# Altium project Main _Rotor_Roll v1.1_Project.PrjPcb
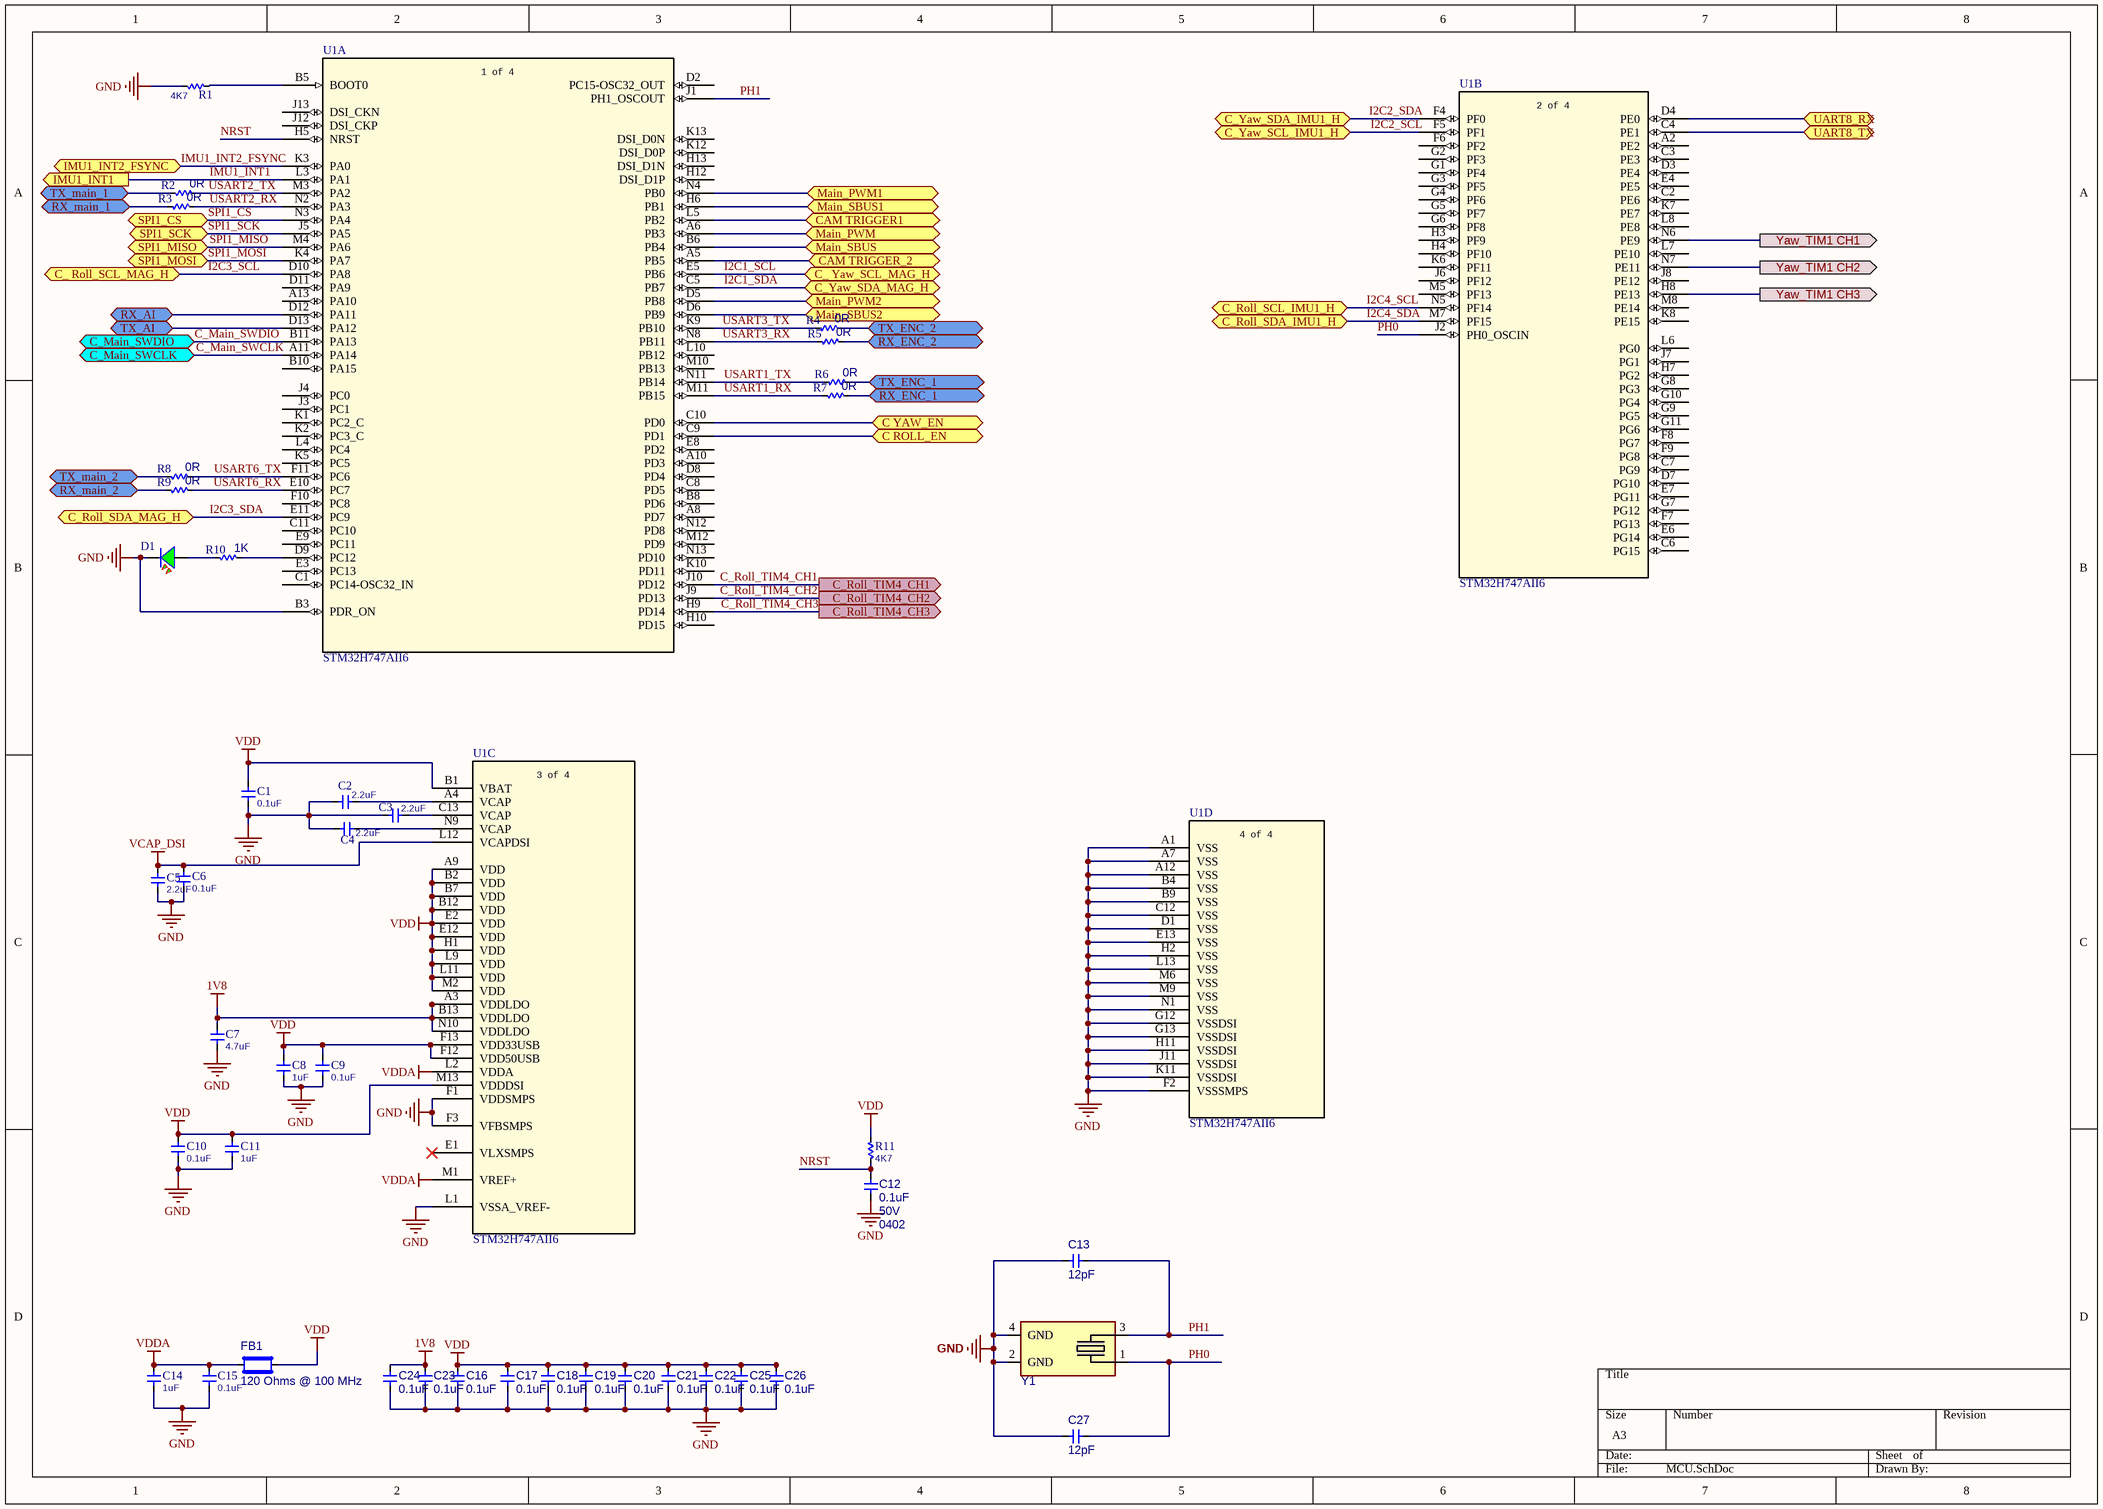
[diagram p0: MCU.SchDoc]
5 sheets, 100 parts. Net scope: flat (ports and power ports of the same name join across sheets).
Board file: MAIN.PcbDoc
Sheets:
  MCU.SchDoc
  PWR.SchDoc
  IMU.SchDoc
  Connector.SchDoc
  RS232.SchDoc

## Sheet MCU.SchDoc
size A3; SheetNumber: 1; SheetTotal: 5

### Parts
C1  value 0.1uF  [CAP0402]  (hidden comment: CAP0402)
C2  value 2.2uF  [CAP0402]  (hidden comment: CAP0402)
C3  value 2.2uF  [CAP0402]  (hidden comment: CAP0402)
C4  value 2.2uF  [CAP0402]  (hidden comment: CAP0402)
C5  value 2.2uF  [CAP0402]  (hidden comment: CAP0402)
C6  value 0.1uF  [CAP0402]  (hidden comment: CAP0402)
C7  value 4.7uF  [CAP0402]  (hidden comment: CAP0402)
C8  value 1uF  [CAP0402]  (hidden comment: CAP0402)
C9  value 0.1uF  [CAP0402]  (hidden comment: CAP0402)
C10  value 0.1uF  [CAP0402]  (hidden comment: CAP0402)
C11  value 1uF  [CAP0402]  (hidden comment: CAP0402)
C12  value 0.1uF  Voltage: 50V  Package: 0402  [CAP0402]  (hidden comment: CAP0402 0.1uF 50V)
C13  value 12pF  [CAP0402]  (hidden comment: CAP0402 12pF 50V)
C14  value 1uF  [CAP0402]  (hidden comment: CAP0402)
C15  value 0.1uF  [CAP0402]  (hidden comment: CAP0402)
C16  value 0.1uF  [CAP0402]  (hidden comment: CAP0402 0.1uF 50V)
C17  value 0.1uF  [CAP0402]  (hidden comment: CAP0402 0.1uF 50V)
C18  value 0.1uF  [CAP0402]  (hidden comment: CAP0402 0.1uF 50V)
C19  value 0.1uF  [CAP0402]  (hidden comment: CAP0402 0.1uF 50V)
C20  value 0.1uF  [CAP0402]  (hidden comment: CAP0402 0.1uF 50V)
C21  value 0.1uF  [CAP0402]  (hidden comment: CAP0402 0.1uF 50V)
C22  value 0.1uF  [CAP0402]  (hidden comment: CAP0402 0.1uF 50V)
C23  value 0.1uF  [CAP0402]  (hidden comment: CAP0402 0.1uF 50V)
C24  value 0.1uF  [CAP0402]  (hidden comment: CAP0402 0.1uF 50V)
C25  value 0.1uF  [CAP0402]  (hidden comment: CAP0402 0.1uF 50V)
C26  value 0.1uF  [CAP0402]  (hidden comment: CAP0402 0.1uF 50V)
C27  value 12pF  [CAP0402]  (hidden comment: CAP0402 12pF 50V)
D1  SML-310MTT86  [LED0603 GREEN]  (value not drawn)
FB1  Impedance @ Frequency: 120 Ohms @ 100 MHz  [FERRIT0402]  (hidden comment: BLM15PX121SZ1D)
R1  value 4K7  [RES0402]  (hidden comment: RES0402 4K7)
R2  value 0R  [RES0402]  (hidden comment: RES0402 0R)
R3  value 0R  [RES0402]  (hidden comment: RES0402 0R)
R4  value 0R  [RES0402]  (hidden comment: RES0402 0R)
R5  value 0R  [RES0402]  (hidden comment: RES0402 0R)
R6  value 0R  [RES0402]  (hidden comment: RES0402 0R)
R7  value 0R  [RES0402]  (hidden comment: RES0402 0R)
R8  value 0R  [RES0402]  (hidden comment: RES0402 0R)
R9  value 0R  [RES0402]  (hidden comment: RES0402 0R)
R10  value 1K  [RES0402]  (hidden comment: RES0402 0R)
R11  value 4K7  [RES0402]  (hidden comment: RES0402 4K7)
U1  STM32H747AII6  [UFBGA169]  (parts A,B,C,D of 4)
Y1  ECS-240-12-37B-CKY-TR  [XTAL_ECS-240-12-37B-CKY-TR]  (value not drawn)

### Ports
C ROLL_EN (bidir), C YAW_EN (bidir), C_ Roll_SCL_MAG_H (bidir), C_ Yaw_SCL_MAG_H (bidir), C_Main_SWCLK (bidir), C_Main_SWDIO (bidir), C_Roll_SCL_IMU1_H (bidir), C_Roll_SDA_IMU1_H (bidir), C_Roll_SDA_MAG_H (bidir), C_Roll_TIM4_CH1 (out), C_Roll_TIM4_CH2 (out), C_Roll_TIM4_CH3 (out), C_Yaw_SCL_IMU1_H (bidir), C_Yaw_SDA_IMU1_H (bidir), C_Yaw_SDA_MAG_H (bidir), CAM TRIGGER1 (bidir), CAM TRIGGER_2 (bidir), IMU1_INT1 (out), IMU1_INT2_FSYNC (bidir), Main_PWM1 (bidir), Main_PWM2 (bidir), Main_PWM (bidir), Main_SBUS1 (bidir), Main_SBUS2 (bidir), Main_SBUS (bidir), RX_AI (bidir), RX_ENC_1 (bidir), RX_ENC_2 (bidir), RX_main_1 (bidir), RX_main_2 (bidir), SPI1_CS (bidir), SPI1_MISO (bidir), SPI1_MOSI (bidir), SPI1_SCK (bidir), TX_AI (bidir), TX_ENC_1 (bidir), TX_ENC_2 (bidir), TX_main_1 (bidir), TX_main_2 (bidir), UART8_RX (bidir), UART8_TX (bidir), Yaw_TIM1 CH1 (out), Yaw_TIM1 CH2 (out), Yaw_TIM1 CH3 (out)

### Nets
1V8: C7.2 C23.2 C24.2 U1.A3(VDDLDO) U1.B13(VDDLDO) U1.N10(VDDLDO)
GND: C1.1 C2.1 C3.1 C4.1 C5.1 C6.1 C7.1 C8.1 C9.1 C10.1 C11.1 C12.1 C13.2 C14.1 C15.1 C16.1 C17.1 C18.1 C19.1 C20.1 C21.1 C22.1 C23.1 C24.1 C25.1 C26.1 C27.2 D1.1 R1.1 U1.A1(VSS) U1.A7(VSS) U1.A12(VSS) U1.B3(PDR_ON) U1.B4(VSS) U1.B9(VSS) U1.C12(VSS) U1.D1(VSS) U1.E13(VSS) U1.F1(VDDSMPS) U1.F2(VSSSMPS) U1.F3(VFBSMPS) U1.G12(VSSDSI) U1.G13(VSSDSI) U1.H2(VSS) U1.H11(VSSDSI) U1.J11(VSSDSI) U1.K11(VSSDSI) U1.L1(VSSA_VREF-) U1.L13(VSS) U1.M6(VSS) U1.M9(VSS) U1.N1(VSS) Y1.2(GND) Y1.4(GND)
VCAP_DSI: C5.2 C6.2 U1.L12(VCAPDSI)
VDD: C1.2 C8.2 C9.2 C10.2 C11.2 C16.2 C17.2 C18.2 C19.2 C20.2 C21.2 C22.2 C25.2 C26.2 FB1.2 R11.2 U1.A9(VDD) U1.B1(VBAT) U1.B2(VDD) U1.B7(VDD) U1.B12(VDD) U1.E2(VDD) U1.E12(VDD) U1.F12(VDD50USB) U1.F13(VDD33USB) U1.H1(VDD) U1.L9(VDD) U1.L11(VDD) U1.M2(VDD) U1.M13(VDDDSI)
VDDA: C14.2 C15.2 FB1.1 U1.L2(VDDA) U1.M1(VREF+)
C_Main_SWCLK: U1.A11(PA14) ; port C_Main_SWCLK
C_Main_SWDIO: U1.B11(PA13) ; port C_Main_SWDIO
C_Roll_TIM4_CH1: U1.J10(PD12) ; port C_Roll_TIM4_CH1
C_Roll_TIM4_CH2: U1.J9(PD13) ; port C_Roll_TIM4_CH2
C_Roll_TIM4_CH3: U1.H9(PD14) ; port C_Roll_TIM4_CH3
C_Yaw_TIM1_CH1: U1.N6(PE9) ; port Yaw_TIM1 CH1
C_Yaw_TIM1_CH2: U1.N7(PE11) ; port Yaw_TIM1 CH2
C_Yaw_TIM1_CH3: U1.H8(PE13) ; port Yaw_TIM1 CH3
I2C1_SCL: U1.E5(PB6) ; port C_ Yaw_SCL_MAG_H
I2C1_SDA: U1.C5(PB7) ; port C_Yaw_SDA_MAG_H
I2C2_SCL: U1.F5(PF1) ; port C_Yaw_SCL_IMU1_H
I2C2_SDA: U1.F4(PF0) ; port C_Yaw_SDA_IMU1_H
I2C3_SCL: U1.D10(PA8) ; port C_ Roll_SCL_MAG_H
I2C3_SDA: U1.E11(PC9) ; port C_Roll_SDA_MAG_H
I2C4_SCL: U1.N5(PF14) ; port C_Roll_SCL_IMU1_H
I2C4_SDA: U1.M7(PF15) ; port C_Roll_SDA_IMU1_H
IMU1_INT1: U1.L3(PA1) ; port IMU1_INT1
IMU1_INT2_FSYNC: U1.K3(PA0) ; port IMU1_INT2_FSYNC
NRST: C12.2 R11.1 U1.H5(NRST)
PH0: C27.1 U1.J2(PH0_OSCIN) Y1.1(IO)
PH1: C13.1 U1.J1(PH1_OSCOUT) Y1.3(IO)
RX_AI: U1.D12(PA11) ; port RX_AI
SPI1_CS: U1.N3(PA4) ; port SPI1_CS
SPI1_MISO: U1.M4(PA6) ; port SPI1_MISO
SPI1_MOSI: U1.K4(PA7) ; port SPI1_MOSI
SPI1_SCK: U1.J5(PA5) ; port SPI1_SCK
TX_AI: U1.D13(PA12) ; port TX_AI
USART1_RX: R7.1 U1.M11(PB15)
USART1_TX: R6.1 U1.N11(PB14)
USART2_RX: R3.2 U1.N2(PA3)
USART2_TX: R2.2 U1.M3(PA2)
USART3_RX: R5.1 U1.N8(PB11)
USART3_TX: R4.1 U1.K9(PB10)
USART6_RX: R9.2 U1.E10(PC7)
USART6_TX: R8.2 U1.F11(PC6)
NetC2_2: C2.2 U1.A4(VCAP)
NetC3_2: C3.2 U1.C13(VCAP)
NetC4_2: C4.2 U1.N9(VCAP)
NetD1_2: D1.2 R10.1
NetP1_11: U1.C10(PD0) ; port C YAW_EN
NetP1_27: U1.B6(PB4) ; port Main_SBUS
NetP1_29: U1.A6(PB3) ; port Main_PWM
NetP1_32: U1.N4(PB0) ; port Main_PWM1
NetP1_34: U1.H6(PB1) ; port Main_SBUS1
NetP1_44: U1.D5(PB8) ; port Main_PWM2
NetP1_46: U1.D6(PB9) ; port Main_SBUS2
NetP2_20: U1.C9(PD1) ; port C ROLL_EN
NetP2_50: U1.L5(PB2) ; port CAM TRIGGER1
NetP2_52: U1.A5(PB5) ; port CAM TRIGGER_2
NetR1_2: R1.2 U1.B5(BOOT0)
NetR2_1: R2.1 ; port TX_main_1
NetR3_1: R3.1 ; port RX_main_1
NetR4_2: R4.2 ; port TX_ENC_2
NetR5_2: R5.2 ; port RX_ENC_2
NetR6_2: R6.2 ; port TX_ENC_1
NetR7_2: R7.2 ; port RX_ENC_1
NetR8_1: R8.1 ; port TX_main_2
NetR9_1: R9.1 ; port RX_main_2
NetR10_2: R10.2 U1.D9(PC12)
NetU1_C4: U1.C4(PE1) ; port UART8_TX
NetU1_D4: U1.D4(PE0) ; port UART8_RX

Not connected (* = marked no-connect by the designer): U1 A2(PE2) A8(PD7) A10(PD3) A13(PA10) B8(PD6) B10(PA15) C1(PC14-OSC32_IN) C2(PE6) C3(PE3) C6(PG15) C7(PG9) C8(PD5) C11(PC10) D2(PC15-OSC32_OUT) D3(PE4) D7(PG10) D8(PD4) D11(PA9) E1(VLXSMPS)* E3(PC13) E4(PE5) E6(PG14) E7(PG11) E8(PD2) E9(PC11) F6(PF2) F7(PG13) F8(PG7) F9(PG8) F10(PC8) G1(PF4) G2(PF3) G3(PF5) G4(PF6) G5(PF7) G6(PF8) G7(PG12) G8(PG3) G9(PG5) G10(PG4) G11(PG6) H3(PF9) H4(PF10) H7(PG2) H10(PD15) H12(DSI_D1P) H13(DSI_D1N) J3(PC1) J4(PC0) J6(PF12) J7(PG1) J8(PE12) J12(DSI_CKP) J13(DSI_CKN) K1(PC2_C) K2(PC3_C) K5(PC5) K6(PF11) K7(PE7) K8(PE15) K10(PD11) K12(DSI_D0P) K13(DSI_D0N) L4(PC4) L6(PG0) L7(PE10) L8(PE8) L10(PB12) M5(PF13) M8(PE14) M10(PB13) M12(PD9) N12(PD8) N13(PD10)

### Notes on the sheet
- (in symbol STM32H747AII6, part A) 1 of 4
- (in symbol STM32H747AII6, part B) 2 of 4
- (in symbol STM32H747AII6, part C) 3 of 4
- (in symbol STM32H747AII6, part D) 4 of 4

### Library data of the parts
C1-C11 C14 C15 = CAP0402: Cap 0402; MP: add later
C12 C16-C26 = CAP0402 0.1uF 50V: Cap 0.1uF 50V 0402; MP: CC0402KRX5R9BB104
  C16-C26: Voltage: 50V; Package: 0402
C13 C27 = CAP0402 12pF 50V: Cap 12pF 50V 0402
D1 = CMP-01130-2: LED GREEN CLEAR 0603 SMD; Manufacturer 1: Rohm Semiconductor; Luminous Intensity: 16mcd; Wavelength: 570nm; Number of LEDs: 1; Color: Green,Yellow; Forward Voltage: 2.2V; Lens Color: Colorless,Clear; Forward Current: 20mA; Viewing Angle: 140°; Lens Style: Rectangular,Clear,Diffused,Colorless; Case Code (Imperial): 0603; Lens Transparency: Clear; Package Quantity: 3000; Width: 0.8mm; Manufacturer Part Number 1: SML-310MTT86; Min Operating Temperature: -30°C; Length: 1.6mm; Packaging: Tape and Reel; Dominant Wavelength: 570nm; Height: 0.9mm; Radiation Hardening: No; Test Current: 20mA; Case Code (Metric): 1608; Lead Free: Lead Free; Case/Package: 0603; Mount: Surface Mount; Max Operating Temperature: 85°C; Illumination Color: Green; Number of Pins: 2
FB1 = BLM15PX121SZ1D: 120 Ohms @ 100 MHz 1 Power Line Ferrite Bead 0402 (1005 Metric) 2A 55mOhm; MP: BLM15PX121SZ1D; Current Rating (Max): 2A; DC Resistance (DCR) (Max): 55mOhm
R1 R11 = RES0402 4K7: RES 4K7 0402; MP: RC0402JR-074K7L
R2-R10 = RES0402 0R: RES 0R 0402; MP: RC0402JR-070RL
U1 = STM32H747AII6: High-performance and DSP with DP-FPU, Arm Cortex-M7 + Cortex-M4 MCU with 2MBytes of Flash memory, 1MB RAM, 480 MHz CPU, Art Accelerator, L1 cache, external memory interface, large set of peripherals, SMPS, MIPI-DSI; Manufacturer_Name: STMicroelectronics; Copyright: Copyright (C) 2026 Ultra Librarian. All rights reserved.; Manufacturer_Part_Number: STM32H747AII6; RefDes: RefDes; Type: Type
Y1 = ECS-240-12-37B-CKY-TR: Crystal 24 MHz ±10ppm 12pF 50 Ohms 4-SMD, No Lead; Frequency: 24 MHz; ESR (Equivalent Series Resistance): 50 Ohms; MP: ECS-240-12-37B-CKY-TR; Frequency Stability: ±10ppm; Frequency Tolerance: ±10ppm; Load Capacitance: 12pF; Operating Temperature: -30°C ~ 85°C; Size / Dimension: 2.00mm x 1.60mm

## Sheet PWR.SchDoc
size A; SheetNumber: 2; SheetTotal: 5
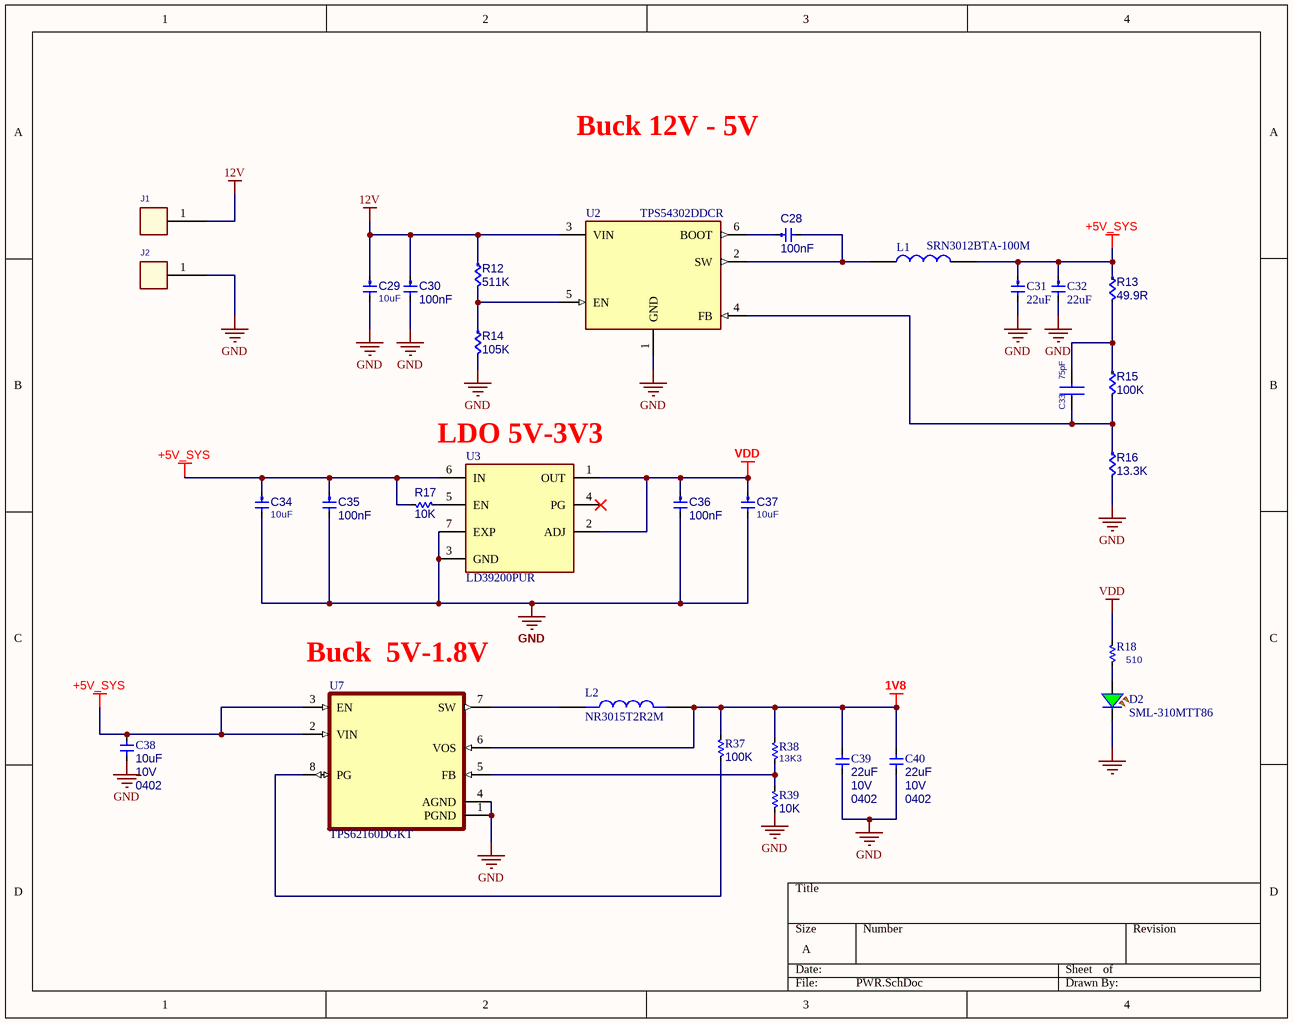
[diagram p1: PWR.SchDoc]

### Parts
(Parts that share a designator on the sheet are numbered #1, #2 ... from top to bottom, then left to right.)
C28  Capacitance: 100nF  [CAP0402]  (hidden comment: CC0402KRX5R9BB104)
C29  Capacitance: 10uF  [CAP0603]  (hidden comment: GRM188R6YA106MA73D)
C30  Capacitance: 100nF  [CAP0402]  (hidden comment: CC0402KRX5R9BB104)
C31  Capacitance: 22uF  [CAP0402]  (hidden comment: GRM158R61A226ME15D)
C32  Capacitance: 22uF  [CAP0402]  (hidden comment: GRM158R61A226ME15D)
C33  75pF  [CAP0402]
C34  Capacitance: 10uF  [CAP0603]  (hidden comment: GRM188R6YA106MA73D)
C35  Capacitance: 100nF  [CAP0402]  (hidden comment: CC0402KRX5R9BB104)
C36  Capacitance: 100nF  [CAP0402]  (hidden comment: CC0402KRX5R9BB104)
C37  Capacitance: 10uF  [CAP0603]  (hidden comment: GRM188R6YA106MA73D)
C38#1  value 10uF  Voltage: 10V  Package: 0402  [CAP0402]  (hidden comment: CAP0402 10uF 10V)
C39#1  value 22uF  Voltage: 10V  Package: 0402  [CAP0402]  (hidden comment: CAP0402 22uF 10V)
C40#1  value 22uF  Voltage: 10V  Package: 0402  [CAP0402]  (hidden comment: CAP0402 22uF 10V)
D2  SML-310MTT86  [LED0603 GREEN]
J1  CON1  [ESC PAD 3X4]  (value not drawn)
J2  CON1  [ESC PAD 3X4]  (value not drawn)
L1  SRN3012BTA-100M  [SRN3012BTA-100M]
L2  NR3015T2R2M  [IND_NR3015T2R2M]
R12  511K  [RES0402]
R13  49.9R  [RES0402]
R14  105K  [RES0402]
R15  100K  [RES0402]
R16  13.3K  [RES0402]
R17  value 10K  [RES0402]  (hidden comment: RES0402 10K)
R18  value 510  [RES0402]  (hidden comment: RES0402)
R37  value 100K  [RES0402]  (hidden comment: RES0402 100K)
R38  value 13K3  [RES0402]  (hidden comment: RES0402 13K3)
R39  value 10K  [RES0402]  (hidden comment: RES0402 10K)
U2  TPS54302DDCR  [SOT95P280X110-6N - duplicate1]
U3  LD39200PUR  [LD39200PUR]
U7  TPS62160DGKT  [SOP65P490X110-8N]

### Nets
1V8: C39#1.2 C40#1.2 L2.2 R37.2 R38.2 U7.6(VOS)
12V: C29.1 C30.1 J1.1 R12.1 U2.3(VIN)
+5V_SYS: C31.1 C32.1 C34.1 C35.1 C38#1.2 L1.2 R13.1 R17.2 U3.6(IN) U7.2(VIN) U7.3(EN)
GND: C29.2 C30.2 C31.2 C32.2 C34.2 C35.2 C36.2 C37.2 C38#1.1 C39#1.1 C40#1.1 D2.1 J2.1 R14.2 R16.2 R39.1 U2.1(GND) U3.3(GND) U3.7(EXP) U7.1(PGND) U7.4(AGND)
VDD: C36.1 C37.1 R18.1 U3.1(OUT) U3.2(ADJ)
NetC28_1: C28.1 U2.6(BOOT)
NetC28_2: C28.2 L1.1 U2.2(SW)
NetC33_1: C33.1 R15.2 R16.1 U2.4(FB)
NetC33_2: C33.2 R13.2 R15.1
NetD2_2: D2.2 R18.2
NetL2_1: L2.1 U7.7(SW)
NetR12_2: R12.2 R14.1 U2.5(EN)
NetR17_1: R17.1 U3.5(EN)
NetR37_1: R37.1 U7.8(PG)
NetR38_1: R38.1 R39.2 U7.5(FB)

Not connected (* = marked no-connect by the designer): U3 4(PG)*

### Notes on the sheet
- Buck 12V - 5V
- (near U3) LDO 5V-3V3
- (near U7) Buck  5V-1.8V

### Library data of the parts
C28 C30 C35 C36 = CMP-00265-1: CAP CER 0.1UF 50V X5R 0402; Manufacturer: Yageo; Tolerance: 10%; Voltage Rating: 50V; Dielectric: X5R; Width: 0.02inch; Thickness: 0.022inch; Packaging: Tape and Reel; Length: 0.039inch; Mount: Surface Mount; Case/Package: 0402; Min Operating Temperature: -55°C; Halogen Free: Halogen Free; Voltage Rating (DC): 50V; Manufacturer Part Number: CC0402KRX5R9BB104; Max Operating Temperature: 85°C; Lead Free: Lead Free; Manufacturer 1: Yageo; Manufacturer Part Number 1: CC0402KRX5R9BB104
C29 C34 C37 = CMP-01031-1: CAP CER 10UF 35V X5R 0603; Manufacturer 1: Murata Electronics; Tolerance: 20%; Case/Package: 0603; Depth: 0.8mm; Composition: Ceramic; Length: 1.6mm; Max Operating Temperature: 85°C; Lead Free: Lead Free; Thickness: 0.031inch; Number of Pins: 2; Weight: 0.000222oz; Min Operating Temperature: -55°C; REACH SVHC: No SVHC; Case Code (Metric): 1608; Termination: SMD/SMT; Packaging: Tape and Reel; Height: 0.8mm; Voltage Rating (DC): 35V; Width: 0.031inch; Voltage Rating: 35V; Manufacturer Part Number 1: GRM188R6YA106MA73D; Mount: Surface Mount; Package Quantity: 1; Case Code (Imperial): 0603; Dielectric: X5R; Voltage: 35V
C31 C32 = CMP-00520-1: CAP CER 22UF 10V X5R 0402; Manufacturer 1: TDK Corporation; Tolerance: 10%; Case Code (Imperial): 0402; Case/Package: 0402; Voltage: 10V; Min Operating Temperature: -55°C; Termination: SMD/SMT; Voltage Rating: 10V; Length: 1mm; REACH SVHC: No SVHC; Max Operating Temperature: 85°C; Radiation Hardening: No; Depth: 0.5mm; Case Code (Metric): 1005; Dielectric: X5R; Manufacturer Part Number 1: GRM158R61A226ME15D; Packaging: Tape and Reel
C33 = CAP_Dup1_16: CAP CER 75PF 25V C0G/NP0 0402; Manufacturer PN: CC0402JRNPO9BN750; Manufacturer: YAGEO; PART_NUMBER: TMP-416; CLASS: DISCRETE; Tolerance: 5%; Temperature Coefficient: C0G, NP0; Dielectric Type: Capacitors; Rated Voltage: 25V; Package Size: 0402 (1005 Metric)
C38#1 = CAP0402 10uF 10V: Cap 10uF 10V 0402; MP: GRT155R61A106ME13D
C39#1 C40#1 = CAP0402 22uF 10V: Cap 22uF 10V 0402; MP: GRM158R61A226ME15D
D2 = CMP-01130-2: as D1 on sheet MCU; Case Code (Imperial): 0603; Lens Transparency: Clear; Package Quantity: 3000; Width: 0.8mm; Manufacturer Part Number 1: SML-310MTT86; Min Operating Temperature: -30°C; Length: 1.6mm; Packaging: Tape and Reel; Dominant Wavelength: 570nm; Height: 0.9mm; Radiation Hardening: No; Test Current: 20mA; Case Code (Metric): 1608; Lead Free: Lead Free; Case/Package: 0603; Mount: Surface Mount; Max Operating Temperature: 85°C; Illumination Color: Green; Number of Pins: 2
J1 J2 = CON1: SOLDER PADS
L1 = SRN3012BTA-330M: 10uH; Manufacturer_Name: Bourns; Geometry.Height: 1.2mm; Mouser Part Number: SRN3012BTA-100M; Mouser Price/Stock: https://www.mouser.co.uk/ProductDetail/Bourns/SRN3012BTA-330M?qs=Imq1NPwxi74rPoSZ4PPaRw%3D%3D; Manufacturer_Part_Number: SRN3012BTA-100M; Datasheet Link: https://www.bourns.com/docs/Product-Datasheets/SRN3012BTA.pdf
L2 = NR3015T2R2M: 2.2 ÂµH Shielded Drum Core, Wirewound Inductor 1.5 A 72mOhm Max Nonstandard; MF: Taiyo Yuden; MP: NR3015T2R2M; Price: None; Purchase-URL: https://pricing.snapeda.com/search/part/NR3015T2R2M/?ref=eda; Package: Nonstandard Taiyo Yuden; Check_prices: https://www.snapeda.com/parts/NR3015T2R2M/Taiyo+Yuden/view-part/?ref=eda; Value: *; Availability: In Stock; SnapEDA_Link: https://www.snapeda.com/parts/NR3015T2R2M/Taiyo+Yuden/view-part/?ref=snap
R12 = CMP-00299-1_1: RES SMD 511K OHM 1% 1/16W 0402; Manufacturer: Yageo; Manufacturer Part Number: RC0402FR-07511KL; Temperature Coefficient: 100ppm/°C; Working Voltage: 50V; Max Power Dissipation: 63mW; Power Rating: 62.5mW; Height: 0.016inch; Package Quantity: 1; Min Operating Temperature: -55°C; Tolerance: 1%; Military Standard: Not; Packaging: Tape and Reel; Number of Terminations: 2; Width: 0.02inch; Case/Package: 0402; Length: 1mm; Voltage Rating (DC): 50V; Case Code (Metric): 1005; Resistance: 511K; Composition: Thick Film; Voltage Rating: 50V; Max Operating Temperature: 155°C; Case Code (Imperial): 0402; Lead Free: Lead Free; Termination: SMD/SMT; Features: Moisture Resistant; Depth: 0.5mm; Manufacturer 1: Yageo; Manufacturer Part Number 1: RC0402FR-07511KL
R13 = CMP-00299-1_1: RES SMD 49.9R OHM 1% 1/16W 0402; Manufacturer: Yageo; Manufacturer Part Number: RC0402FR-0749R9L; Temperature Coefficient: 100ppm/°C; Working Voltage: 50V; Max Power Dissipation: 63mW; Power Rating: 62.5mW; Height: 0.016inch; Package Quantity: 1; Min Operating Temperature: -55°C; Tolerance: 1%; Military Standard: Not; Packaging: Tape and Reel; Number of Terminations: 2; Width: 0.02inch; Case/Package: 0402; Length: 1mm; Voltage Rating (DC): 50V; Case Code (Metric): 1005; Resistance: 49.9R; Composition: Thick Film; Voltage Rating: 50V; Max Operating Temperature: 155°C; Case Code (Imperial): 0402; Lead Free: Lead Free; Termination: SMD/SMT; Features: Moisture Resistant; Depth: 0.5mm; Manufacturer 1: Yageo; Manufacturer Part Number 1: RC0402FR-0749R9L
R14 = CMP-00299-1_1: RES SMD 105K OHM 1% 1/16W 0402; Manufacturer: Yageo; Manufacturer Part Number: RC0402FR-07105KL; Temperature Coefficient: 100ppm/°C; Working Voltage: 50V; Max Power Dissipation: 63mW; Power Rating: 62.5mW; Height: 0.016inch; Package Quantity: 1; Min Operating Temperature: -55°C; Tolerance: 1%; Military Standard: Not; Packaging: Tape and Reel; Number of Terminations: 2; Width: 0.02inch; Case/Package: 0402; Length: 1mm; Voltage Rating (DC): 50V; Case Code (Metric): 1005; Resistance: 105K; Composition: Thick Film; Voltage Rating: 50V; Max Operating Temperature: 155°C; Case Code (Imperial): 0402; Lead Free: Lead Free; Termination: SMD/SMT; Features: Moisture Resistant; Depth: 0.5mm; Manufacturer 1: Yageo; Manufacturer Part Number 1: RC0402FR-07105KL
R15 = CMP-00299-1_1: RES SMD 100K OHM 1% 1/16W 0402; Manufacturer: Yageo; Manufacturer Part Number: RC0402FR-0749R9L; Temperature Coefficient: 100ppm/°C; Working Voltage: 50V; Max Power Dissipation: 63mW; Resistance: 49.9R; Power Rating: 62.5mW; Height: 0.016inch; Package Quantity: 1; Min Operating Temperature: -55°C; Tolerance: 1%; Military Standard: Not; Packaging: Tape and Reel; Number of Terminations: 2; Width: 0.02inch; Case/Package: 0402; Length: 1mm; Voltage Rating (DC): 50V; Case Code (Metric): 1005; Composition: Thick Film; Voltage Rating: 50V; Max Operating Temperature: 155°C; Case Code (Imperial): 0402; Lead Free: Lead Free; Termination: SMD/SMT; Features: Moisture Resistant; Depth: 0.5mm; Manufacturer 1: Yageo; Manufacturer Part Number 1: RC0402FR-0749R9L
R16 = CMP-00299-1_1: RES SMD 13.3K OHM 1% 1/16W 0402; Manufacturer: Yageo; Manufacturer Part Number: RC0402FR-0749R9L; Temperature Coefficient: 100ppm/°C; Working Voltage: 50V; Max Power Dissipation: 63mW; Resistance: 49.9R; Power Rating: 62.5mW; Height: 0.016inch; Package Quantity: 1; Min Operating Temperature: -55°C; Tolerance: 1%; Military Standard: Not; Packaging: Tape and Reel; Number of Terminations: 2; Width: 0.02inch; Case/Package: 0402; Length: 1mm; Voltage Rating (DC): 50V; Case Code (Metric): 1005; Composition: Thick Film; Voltage Rating: 50V; Max Operating Temperature: 155°C; Case Code (Imperial): 0402; Lead Free: Lead Free; Termination: SMD/SMT; Features: Moisture Resistant; Depth: 0.5mm; Manufacturer 1: Yageo; Manufacturer Part Number 1: RC0402FR-0749R9L
R17 R39 = RES0402 10K: RES 10K 0402; MP: RC0402FR-0710KL
R18 = RES0402: RES 0402; MP: add later
R37 = RES0402 100K: RES 100K 0402; MP: RC0402FR-07100KL
R38 = RES0402 13K3: RES 13K3 0402; MP: RC0402FR-0713K3L
U2 = TPS54302DDCR: 4.5-V to 28-V Input, 3-A Output, EMI Friendly Synchronous Step-Down Converter; MF: Texas Instruments; Package: SOT-23-THN-6 Texas Instruments; Price: None; Check_prices: https://www.snapeda.com/parts/TPS54302DDCR/Texas+Instruments/view-part/?ref=eda; Value: *; SnapEDA_Link: https://www.snapeda.com/parts/TPS54302DDCR/Texas+Instruments/view-part/?ref=snap; MP: TPS54302DDCR; Availability: In Stock; Purchase-URL: https://pricing.snapeda.com/search?q=TPS54302DDCR&ref=eda
U3 = LD39200PUR: LDO IC 1 Output 2A 6-DFN _3x3_; MF: STMicroelectronics; Package: DFN-6 STMicroelectronics; Availability: Unavailable; MP: LD39200PUR; Value: *; SnapEDA_Link: https://www.snapeda.com/parts/LD39200PUR/STMicroelectronics/view-part/882017/?ref=snap; Price: None
U7 = TPS62160DGKT: 3V-17V 1A Step-Down Converters with DCS-Controlâ„¢; MF: Texas Instruments; SnapEDA_Link: https://www.snapeda.com/parts/TPS62160DGKT/Texas+Instruments/view-part/?ref=snap; Package: VSSOP-8 Texas Instruments; Value: *; MP: TPS62160DGKT; Check_prices: https://www.snapeda.com/parts/TPS62160DGKT/Texas+Instruments/view-part/?ref=eda

## Sheet IMU.SchDoc
size A; SheetNumber: 3; SheetTotal: 5
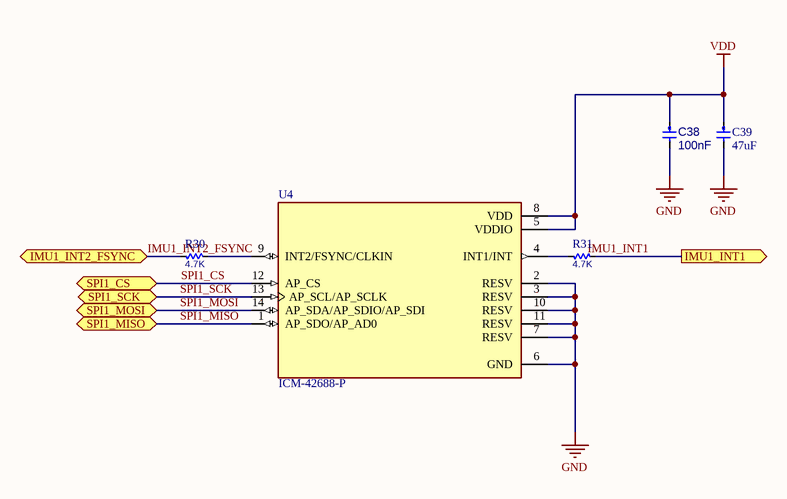
[diagram p2: IMU.SchDoc]

### Parts
(Parts that share a designator on the sheet are numbered #1, #2 ... from top to bottom, then left to right.)
C38#2  Capacitance: 100nF  [CAP0603]  (hidden comment: C0603C104M5RACTU)
C39#2  Capacitance: 47uF  [CAP0805]  (hidden comment: CL21A476MQYNNNE)
R30  value 4.7K  [RES0402]  (hidden comment: RES0402)
R31  value 4.7K  [RES0402]  (hidden comment: RES0402)
U4  ICM-42688-P  [ICM-42688-P]

### Ports
IMU1_INT1 (out), IMU1_INT2_FSYNC (bidir), SPI1_CS (bidir), SPI1_MISO (bidir), SPI1_MOSI (bidir), SPI1_SCK (bidir)

### Nets
GND: C38#2.2 C39#2.2 U4.2(RESV) U4.3(RESV) U4.6(GND) U4.7(RESV) U4.10(RESV) U4.11(RESV)
VDD: C38#2.1 C39#2.1 U4.5(VDDIO) U4.8(VDD)
IMU1_INT1: R31.2 ; port IMU1_INT1
IMU1_INT2_FSYNC: R30.1 ; port IMU1_INT2_FSYNC
SPI1_CS: U4.12(AP_CS) ; port SPI1_CS
SPI1_MISO: U4.1(AP_SDO/AP_AD0) ; port SPI1_MISO
SPI1_MOSI: U4.14(AP_SDA/AP_SDIO/AP_SDI) ; port SPI1_MOSI
SPI1_SCK: U4.13(AP_SCL/AP_SCLK) ; port SPI1_SCK
NetR30_2: R30.2 U4.9(INT2/FSYNC/CLKIN)
NetR31_1: R31.1 U4.4(INT1/INT)

### Notes on the sheet
- Labels drawn without touching a wire or pin: IMU1_INT1

### Library data of the parts
C38#2 = CMP-00691-1: CAP CER 0.1UF 50V X7R 0603; Manufacturer 1: KEMET; Tolerance: 20%; Dielectric Material: Ceramic; Dissipation Factor: 2.5%; Packaging: Tape and Reel; Mount: Surface Mount,PCB; Min Operating Temperature: -55°C; Case/Package: 0603; Max Operating Temperature: 125°C; Length: 1.6mm; Voltage Rating: 50V; Width: 0.031inch; Voltage Rating (DC): 50V; Dielectric: X7R; Thickness: 0.034inch; Case Code (Imperial): 0603; Case Code (Metric): 1608; Contact Plating: Tin,Matte; Depth: 0.8mm; Height: 0.8mm; Lead Pitch: 0.7mm; Manufacturer Part Number 1: C0603C104M5RACTU; Package Quantity: 1; Radiation Hardening: No; REACH SVHC: No SVHC; Termination: SMD/SMT
C39#2 = 885012107014: CAP CER 47UF 6.3V X5R 0805; Tolerance: 20%; Manufacturer Part Number: CL21A476MQYNNNE; RoHS: Yes; Category: Ceramic Capacitors; Stock 1: 3580; Pricing 1: 1=0.37000, 5=0.35200, 10=0.33000, 25=0.31900, 50=0.30900, 100=0.29800 (USD); Mount: Surface Mount; Case/Package: 0805; Case Code (Metric): 2012; Case Code (Imperial): 0805; Min Operating Temperature: -55°C; Max Operating Temperature: 85°C; Packaging: Cut Tape; Voltage Rating: 6.3V; Dielectric: X5R; Voltage Rating (DC): 6.3V; Series: WCAP-CSGP; Length: 0.079inch; Width: 0.049inch; Thickness: 0.057inch; RoHS Compliant: Yes; ComponentLink1URL: http://www.farnell.com/datasheets/1958454.pdf?src-supplier=Farnell; ComponentLink1Description: http://www.farnell.com/datasheets/1958454.pdf?src-supplier=Farnell; ComponentLink2URL: http://www.farnell.com/datasheets/1958454.pdf?src-supplier=Element14; ComponentLink2Description: http://www.farnell.com/datasheets/1958454.pdf?src-supplier=Element14; ComponentLink3URL: https://katalog.we-online.de/pbs/datasheet/885012107014.pdf?src-supplier=Digi-Key; ComponentLink3Description: https://katalog.we-online.de/pbs/datasheet/885012107014.pdf?src-supplier=Digi-Key; ComponentLink4URL: http://www.farnell.com/datasheets/1958454.pdf?src-supplier=Newark; ComponentLink4Description: http://www.farnell.com/datasheets/1958454.pdf?src-supplier=Newark; Supplier 1: Newark
R30 R31 = RES0402: RES 0402; MP: add later
U4 = ICM-42688-P: Accelerometer, Gyroscope, 6 Axis Sensor Output; Package: None; MP: ICM-42688-P; Value: *; Availability: Unavailable; Price: None

## Sheet Connector.SchDoc
size A3; SheetNumber: 4; SheetTotal: 5
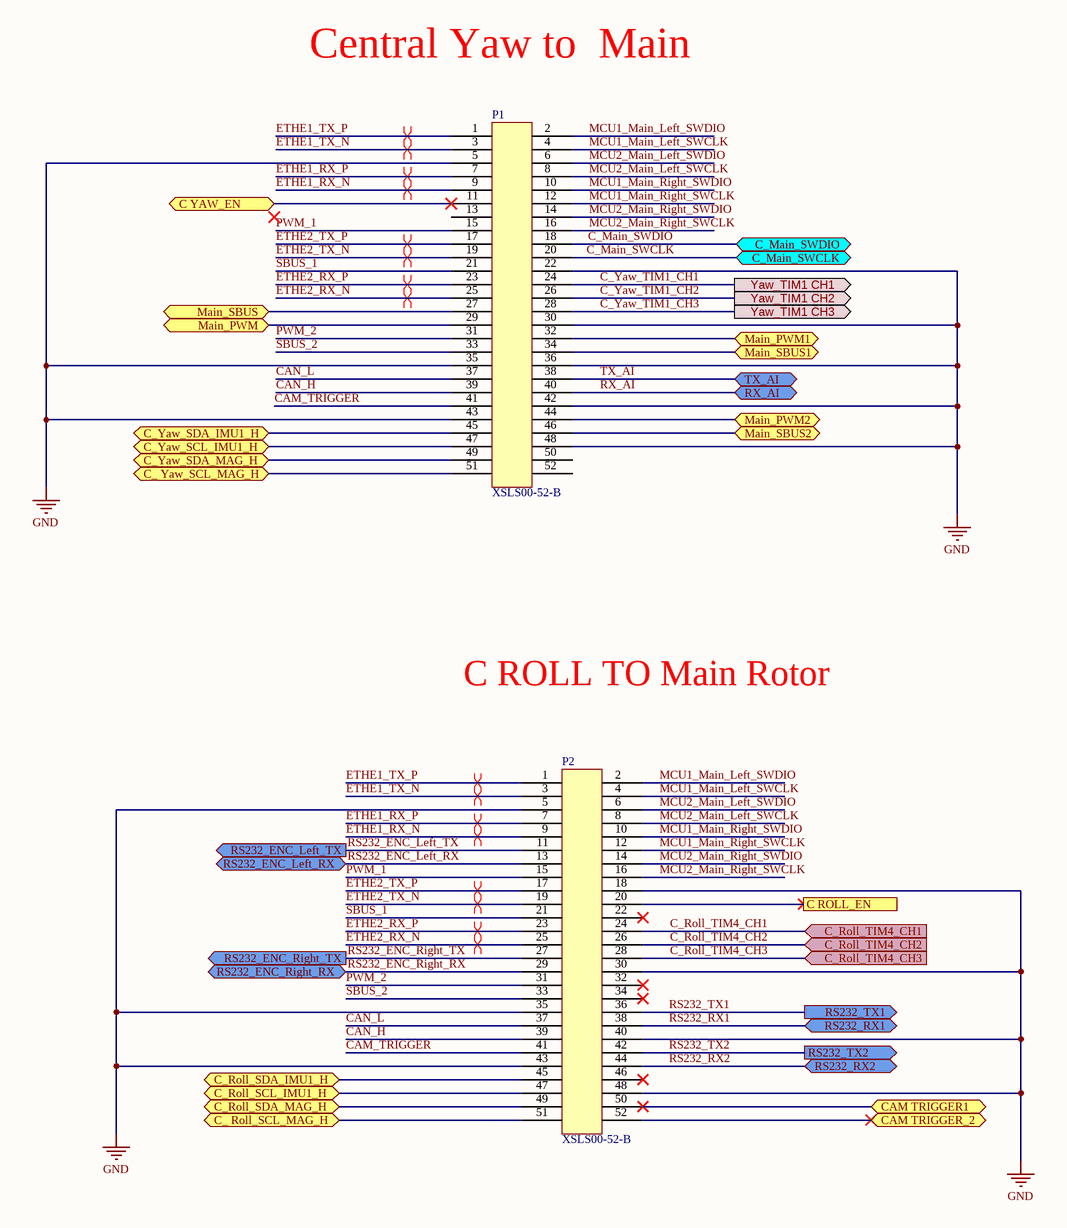
[diagram p3: Connector.SchDoc]

### Parts
P1  XSLS00-52-B  [XSXL52]
P2  XSLS00-52-B  [XSXL52]

### Ports
C ROLL_EN, C YAW_EN (bidir), C_ Roll_SCL_MAG_H (bidir), C_ Yaw_SCL_MAG_H (bidir), C_Main_SWCLK (bidir), C_Main_SWDIO (bidir), C_Roll_SCL_IMU1_H (bidir), C_Roll_SDA_IMU1_H (bidir), C_Roll_SDA_MAG_H (bidir), C_Roll_TIM4_CH1 (in), C_Roll_TIM4_CH2 (in), C_Roll_TIM4_CH3 (in), C_Yaw_SCL_IMU1_H (bidir), C_Yaw_SDA_IMU1_H (bidir), C_Yaw_SDA_MAG_H (bidir), CAM TRIGGER1 (bidir), CAM TRIGGER_2 (bidir), Main_PWM1 (bidir), Main_PWM2 (bidir), Main_PWM (bidir), Main_SBUS1 (bidir), Main_SBUS2 (bidir), Main_SBUS (bidir), RS232_ENC_Left_RX (bidir), RS232_ENC_Left_TX (out), RS232_ENC_Right_RX (bidir), RS232_ENC_Right_TX (out), RS232_RX1 (bidir), RS232_RX2 (bidir), RS232_TX1 (out), RS232_TX2 (out), RX_AI (bidir), TX_AI (bidir), Yaw_TIM1 CH1 (out), Yaw_TIM1 CH2 (out), Yaw_TIM1 CH3 (out)

### Nets
GND: P1.5 P1.22 P1.30 P1.35 P1.36 P1.42 P1.43 P1.48 P2.5 P2.18 P2.30 P2.35 P2.40 P2.43 P2.48
C_Main_SWCLK: P1.20 ; port C_Main_SWCLK
C_Main_SWDIO: P1.18 ; port C_Main_SWDIO
C_Roll_TIM4_CH1: P2.24 ; port C_Roll_TIM4_CH1
C_Roll_TIM4_CH2: P2.26 ; port C_Roll_TIM4_CH2
C_Roll_TIM4_CH3: P2.28 ; port C_Roll_TIM4_CH3
C_Yaw_TIM1_CH1: P1.24 ; port Yaw_TIM1 CH1
C_Yaw_TIM1_CH2: P1.26 ; port Yaw_TIM1 CH2
C_Yaw_TIM1_CH3: P1.28 ; port Yaw_TIM1 CH3
CAM_TRIGGER: P1.41 P2.41
CAN_H: P1.39 P2.39
CAN_L: P1.37 P2.37
ETHE1_RX_N: P1.9 P2.9
ETHE1_RX_P: P1.7 P2.7
ETHE1_TX_N: P1.3 P2.3
ETHE1_TX_P: P1.1 P2.1
ETHE2_RX_N: P1.25 P2.25
ETHE2_RX_P: P1.23 P2.23
ETHE2_TX_N: P1.19 P2.19
ETHE2_TX_P: P1.17 P2.17
I2C1_SCL: P1.51 ; port C_ Yaw_SCL_MAG_H
I2C1_SDA: P1.49 ; port C_Yaw_SDA_MAG_H
I2C2_SCL: P1.47 ; port C_Yaw_SCL_IMU1_H
I2C2_SDA: P1.45 ; port C_Yaw_SDA_IMU1_H
I2C3_SCL: P2.51 ; port C_ Roll_SCL_MAG_H
I2C3_SDA: P2.49 ; port C_Roll_SDA_MAG_H
I2C4_SCL: P2.47 ; port C_Roll_SCL_IMU1_H
I2C4_SDA: P2.45 ; port C_Roll_SDA_IMU1_H
MCU1_Main_Left_SWCLK: P1.4 P2.4
MCU1_Main_Left_SWDIO: P1.2 P2.2
MCU1_Main_Right_SWCLK: P1.12 P2.12
MCU1_Main_Right_SWDIO: P1.10 P2.10
MCU2_Main_Left_SWCLK: P1.8 P2.8
MCU2_Main_Left_SWDIO: P1.6 P2.6
MCU2_Main_Right_SWCLK: P1.16 P2.16
MCU2_Main_Right_SWDIO: P1.14 P2.14
PWM_1: P1.15 P2.15
PWM_2: P1.31 P2.31
RS232_ENC_Left_RX: P2.13 ; port RS232_ENC_Left_RX
RS232_ENC_Left_TX: P2.11 ; port RS232_ENC_Left_TX
RS232_ENC_Right_RX: P2.29 ; port RS232_ENC_Right_RX
RS232_ENC_Right_TX: P2.27 ; port RS232_ENC_Right_TX
RS232_RX1: P2.38 ; port RS232_RX1
RS232_RX2: P2.44 ; port RS232_RX2
RS232_TX1: P2.36 ; port RS232_TX1
RS232_TX2: P2.42 ; port RS232_TX2
RX_AI: P1.40 ; port RX_AI
SBUS_1: P1.21 P2.21
SBUS_2: P1.33 P2.33
TX_AI: P1.38 ; port TX_AI
NetP1_11: P1.11 ; port C YAW_EN
NetP1_27: P1.27 ; port Main_SBUS
NetP1_29: P1.29 ; port Main_PWM
NetP1_32: P1.32 ; port Main_PWM1
NetP1_34: P1.34 ; port Main_SBUS1
NetP1_44: P1.44 ; port Main_PWM2
NetP1_46: P1.46 ; port Main_SBUS2
NetP2_20: P2.20 ; port C ROLL_EN
NetP2_50: P2.50 ; port CAM TRIGGER1
NetP2_52: P2.52 ; port CAM TRIGGER_2

Not connected (* = marked no-connect by the designer): P1 13 50 52; P2 22* 32* 34* 46*

### Layout directives
differential pair: ETHE1_RX_N, ETHE1_RX_P, ETHE1_TX_N, ETHE1_TX_P, ETHE2_RX_N, ETHE2_RX_P, ETHE2_TX_N, ETHE2_TX_P

### Notes on the sheet
- Central Yaw to  Main
- C ROLL TO Main Rotor

## Sheet RS232.SchDoc
size A; SheetNumber: 5; SheetTotal: 5
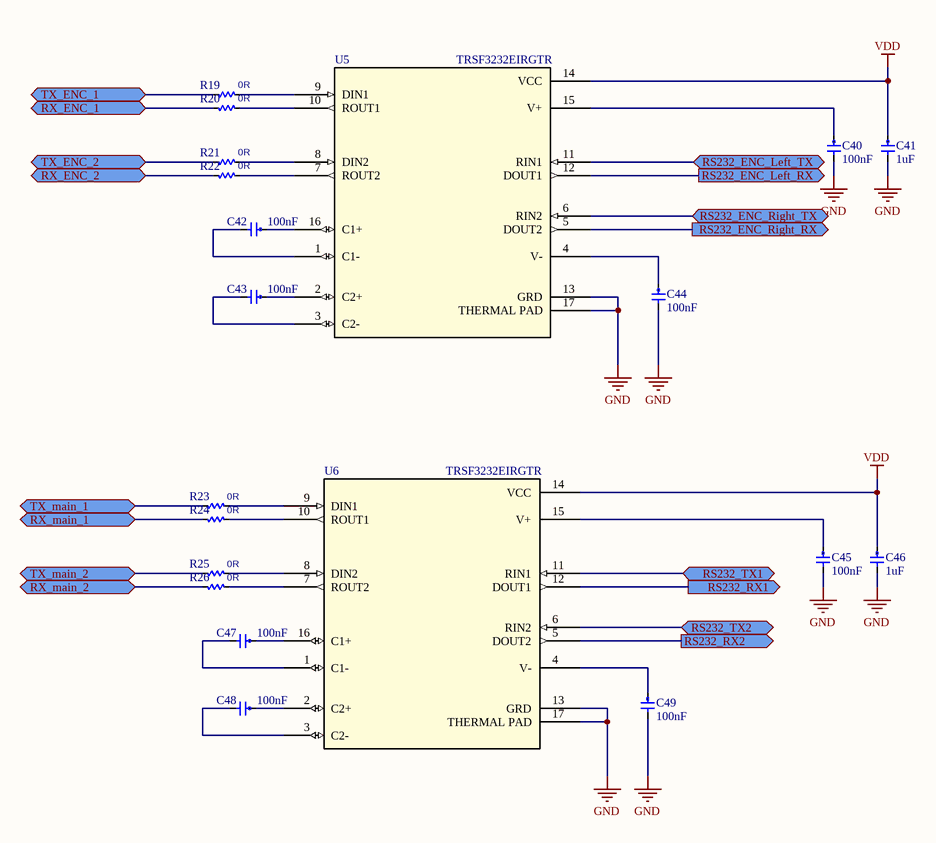
[diagram p4: RS232.SchDoc]

### Parts
(Parts that share a designator on the sheet are numbered #1, #2 ... from top to bottom, then left to right.)
C40#2  Capacitance: 100nF  [CAP0402]  (hidden comment: GRM155R71H104KE14D)
C41  Capacitance: 1uF  [CAP0402]  (hidden comment: CC0402KRX5R8BB105)
C42  Capacitance: 100nF  [CAP0402]  (hidden comment: GRM155R71H104KE14D)
C43  Capacitance: 100nF  [CAP0402]  (hidden comment: GRM155R71H104KE14D)
C44  Capacitance: 100nF  [CAP0402]  (hidden comment: GRM155R71H104KE14D)
C45  Capacitance: 100nF  [CAP0402]  (hidden comment: GRM155R71H104KE14D)
C46  Capacitance: 1uF  [CAP0402]  (hidden comment: CC0402KRX5R8BB105)
C47  Capacitance: 100nF  [CAP0402]  (hidden comment: GRM155R71H104KE14D)
C48  Capacitance: 100nF  [CAP0402]  (hidden comment: GRM155R71H104KE14D)
C49  Capacitance: 100nF  [CAP0402]  (hidden comment: GRM155R71H104KE14D)
R19  value 0R  [RES0402]  (hidden comment: RES0402)
R20  value 0R  [RES0402]  (hidden comment: RES0402)
R21  value 0R  [RES0402]  (hidden comment: RES0402)
R22  value 0R  [RES0402]  (hidden comment: RES0402)
R23  value 0R  [RES0402]  (hidden comment: RES0402)
R24  value 0R  [RES0402]  (hidden comment: RES0402)
R25  value 0R  [RES0402]  (hidden comment: RES0402)
R26  value 0R  [RES0402]  (hidden comment: RES0402)
U5  TRSF3232EIRGTR  [VQFN_2EIRGTR_TEX]
U6  TRSF3232EIRGTR  [VQFN_2EIRGTR_TEX]

### Ports
RS232_ENC_Left_RX (out), RS232_ENC_Left_TX (bidir), RS232_ENC_Right_RX (out), RS232_ENC_Right_TX (bidir), RS232_RX1 (out), RS232_RX2 (out), RS232_TX1 (bidir), RS232_TX2 (bidir), RX_ENC_1 (bidir), RX_ENC_2 (bidir), RX_main_1 (bidir), RX_main_2 (bidir), TX_ENC_1 (bidir), TX_ENC_2 (bidir), TX_main_1 (bidir), TX_main_2 (bidir)

### Nets
GND: C40#2.2 C41.2 C44.2 C45.2 C46.2 C49.2 U5.13(GRD) U5.17(THERMAL_PAD) U6.13(GRD) U6.17(THERMAL_PAD)
VDD: C41.1 C46.1 U5.14(VCC) U6.14(VCC)
RS232_ENC_Left_RX: U5.12(DOUT1) ; port RS232_ENC_Left_RX
RS232_ENC_Left_TX: U5.11(RIN1) ; port RS232_ENC_Left_TX
RS232_ENC_Right_RX: U5.5(DOUT2) ; port RS232_ENC_Right_RX
RS232_ENC_Right_TX: U5.6(RIN2) ; port RS232_ENC_Right_TX
RS232_RX1: U6.12(DOUT1) ; port RS232_RX1
RS232_RX2: U6.5(DOUT2) ; port RS232_RX2
RS232_TX1: U6.11(RIN1) ; port RS232_TX1
RS232_TX2: U6.6(RIN2) ; port RS232_TX2
NetC40#2_1: C40#2.1 U5.15(V+)
NetC42_1: C42.1 U5.16(C1+)
NetC42_2: C42.2 U5.1(C1-)
NetC43_1: C43.1 U5.2(C2+)
NetC43_2: C43.2 U5.3(C2-)
NetC44_1: C44.1 U5.4(V-)
NetC45_1: C45.1 U6.15(V+)
NetC47_1: C47.1 U6.16(C1+)
NetC47_2: C47.2 U6.1(C1-)
NetC48_1: C48.1 U6.2(C2+)
NetC48_2: C48.2 U6.3(C2-)
NetC49_1: C49.1 U6.4(V-)
NetR2_1: R23.1 ; port TX_main_1
NetR3_1: R24.1 ; port RX_main_1
NetR4_2: R21.1 ; port TX_ENC_2
NetR5_2: R22.1 ; port RX_ENC_2
NetR6_2: R19.1 ; port TX_ENC_1
NetR7_2: R20.1 ; port RX_ENC_1
NetR8_1: R25.1 ; port TX_main_2
NetR9_1: R26.1 ; port RX_main_2
NetR19_2: R19.2 U5.9(DIN1)
NetR20_2: R20.2 U5.10(ROUT1)
NetR21_2: R21.2 U5.8(DIN2)
NetR22_2: R22.2 U5.7(ROUT2)
NetR23_2: R23.2 U6.9(DIN1)
NetR24_2: R24.2 U6.10(ROUT1)
NetR25_2: R25.2 U6.8(DIN2)
NetR26_2: R26.2 U6.7(ROUT2)

### Library data of the parts
C40#2 C42-C45 C47-C49 = CMP-01036-1: CAP CER 0.1UF 50V X7R 0402; Manufacturer 1: Murata Electronics; Dielectric Material: Ceramic; Tolerance: 10%; Dissipation Factor: 0.025%; Termination: SMD/SMT; Voltage Rating: 50V; Composition: Ceramic; Max Operating Temperature: 125°C; REACH SVHC: No SVHC; Case/Package: 0402; Case Code (Imperial): 0402; Material: Ceramic; Manufacturer Part Number 1: GRM155R71H104KE14D; Weight: 0.000212oz; Width: 0.5mm; Package Quantity: 10000; Packaging: Tape and Reel; Mount: Surface Mount; Voltage Rating (DC): 50V; Dielectric: X7R; Depth: 0.5mm; Case Code (Metric): 1005; Length: 1mm; Height: 0.5mm; Min Operating Temperature: -55°C; Thickness: 0.022inch; Lead Free: Lead Free; Voltage: 50V
C41 C46 = CMP-00520-1: CAP CER 1UF 25V X5R 0402; Manufacturer 1: TDK Corporation; Tolerance: 10%; Case Code (Imperial): 0402; Case/Package: 0402; Voltage: 25V; Min Operating Temperature: -55°C; Termination: SMD/SMT; Voltage Rating: 25V; Length: 1mm; REACH SVHC: No SVHC; Max Operating Temperature: 85°C; Radiation Hardening: No; Depth: 0.5mm; Case Code (Metric): 1005; Dielectric: X5R; Manufacturer Part Number 1: CC0402KRX5R8BB105; Packaging: Tape and Reel
R19-R26 = RES0402: RES 0402; MP: add later
U5 U6 = TRSF3232EIRGTR: No Description Available; Mfr_Name: Texas Instruments; RefDes: RefDes; Type: Type

## Nets that join several sheets
1V8: MCU (6 pins), PWR (6 pins)
GND: MCU (54 pins), PWR (21 pins), IMU (8 pins), Connector (15 pins), RS232 (10 pins)
VDD: MCU (30 pins), PWR (5 pins), IMU (C38#2.1 C39#2.1 U4.5 U4.8), RS232 (C41.1 C46.1 U5.14 U6.14)
C_Main_SWCLK: MCU (U1.A11), Connector (P1.20)
C_Main_SWDIO: MCU (U1.B11), Connector (P1.18)
C_Roll_TIM4_CH1: MCU (U1.J10), Connector (P2.24)
C_Roll_TIM4_CH2: MCU (U1.J9), Connector (P2.26)
C_Roll_TIM4_CH3: MCU (U1.H9), Connector (P2.28)
C_Yaw_TIM1_CH1: MCU (U1.N6), Connector (P1.24)
C_Yaw_TIM1_CH2: MCU (U1.N7), Connector (P1.26)
C_Yaw_TIM1_CH3: MCU (U1.H8), Connector (P1.28)
I2C1_SCL: MCU (U1.E5), Connector (P1.51)
I2C1_SDA: MCU (U1.C5), Connector (P1.49)
I2C2_SCL: MCU (U1.F5), Connector (P1.47)
I2C2_SDA: MCU (U1.F4), Connector (P1.45)
I2C3_SCL: MCU (U1.D10), Connector (P2.51)
I2C3_SDA: MCU (U1.E11), Connector (P2.49)
I2C4_SCL: MCU (U1.N5), Connector (P2.47)
I2C4_SDA: MCU (U1.M7), Connector (P2.45)
IMU1_INT1: MCU (U1.L3), IMU (R31.2)
IMU1_INT2_FSYNC: MCU (U1.K3), IMU (R30.1)
NetP1_11: MCU (U1.C10), Connector (P1.11)
NetP1_27: MCU (U1.B6), Connector (P1.27)
NetP1_29: MCU (U1.A6), Connector (P1.29)
NetP1_32: MCU (U1.N4), Connector (P1.32)
NetP1_34: MCU (U1.H6), Connector (P1.34)
NetP1_44: MCU (U1.D5), Connector (P1.44)
NetP1_46: MCU (U1.D6), Connector (P1.46)
NetP2_20: MCU (U1.C9), Connector (P2.20)
NetP2_50: MCU (U1.L5), Connector (P2.50)
NetP2_52: MCU (U1.A5), Connector (P2.52)
NetR2_1: MCU (R2.1), RS232 (R23.1)
NetR3_1: MCU (R3.1), RS232 (R24.1)
NetR4_2: MCU (R4.2), RS232 (R21.1)
NetR5_2: MCU (R5.2), RS232 (R22.1)
NetR6_2: MCU (R6.2), RS232 (R19.1)
NetR7_2: MCU (R7.2), RS232 (R20.1)
NetR8_1: MCU (R8.1), RS232 (R25.1)
NetR9_1: MCU (R9.1), RS232 (R26.1)
RS232_ENC_Left_RX: Connector (P2.13), RS232 (U5.12)
RS232_ENC_Left_TX: Connector (P2.11), RS232 (U5.11)
RS232_ENC_Right_RX: Connector (P2.29), RS232 (U5.5)
RS232_ENC_Right_TX: Connector (P2.27), RS232 (U5.6)
RS232_RX1: Connector (P2.38), RS232 (U6.12)
RS232_RX2: Connector (P2.44), RS232 (U6.5)
RS232_TX1: Connector (P2.36), RS232 (U6.11)
RS232_TX2: Connector (P2.42), RS232 (U6.6)
RX_AI: MCU (U1.D12), Connector (P1.40)
SPI1_CS: MCU (U1.N3), IMU (U4.12)
SPI1_MISO: MCU (U1.M4), IMU (U4.1)
SPI1_MOSI: MCU (U1.K4), IMU (U4.14)
SPI1_SCK: MCU (U1.J5), IMU (U4.13)
TX_AI: MCU (U1.D13), Connector (P1.38)